# Altium schematic sheet NvideaJetsonPeripherals.SchDoc: Nvidea Jetson Peripherals
size A3; Organization: WACT^2 (QUT) - DRC; Address1: Cooper Richmond
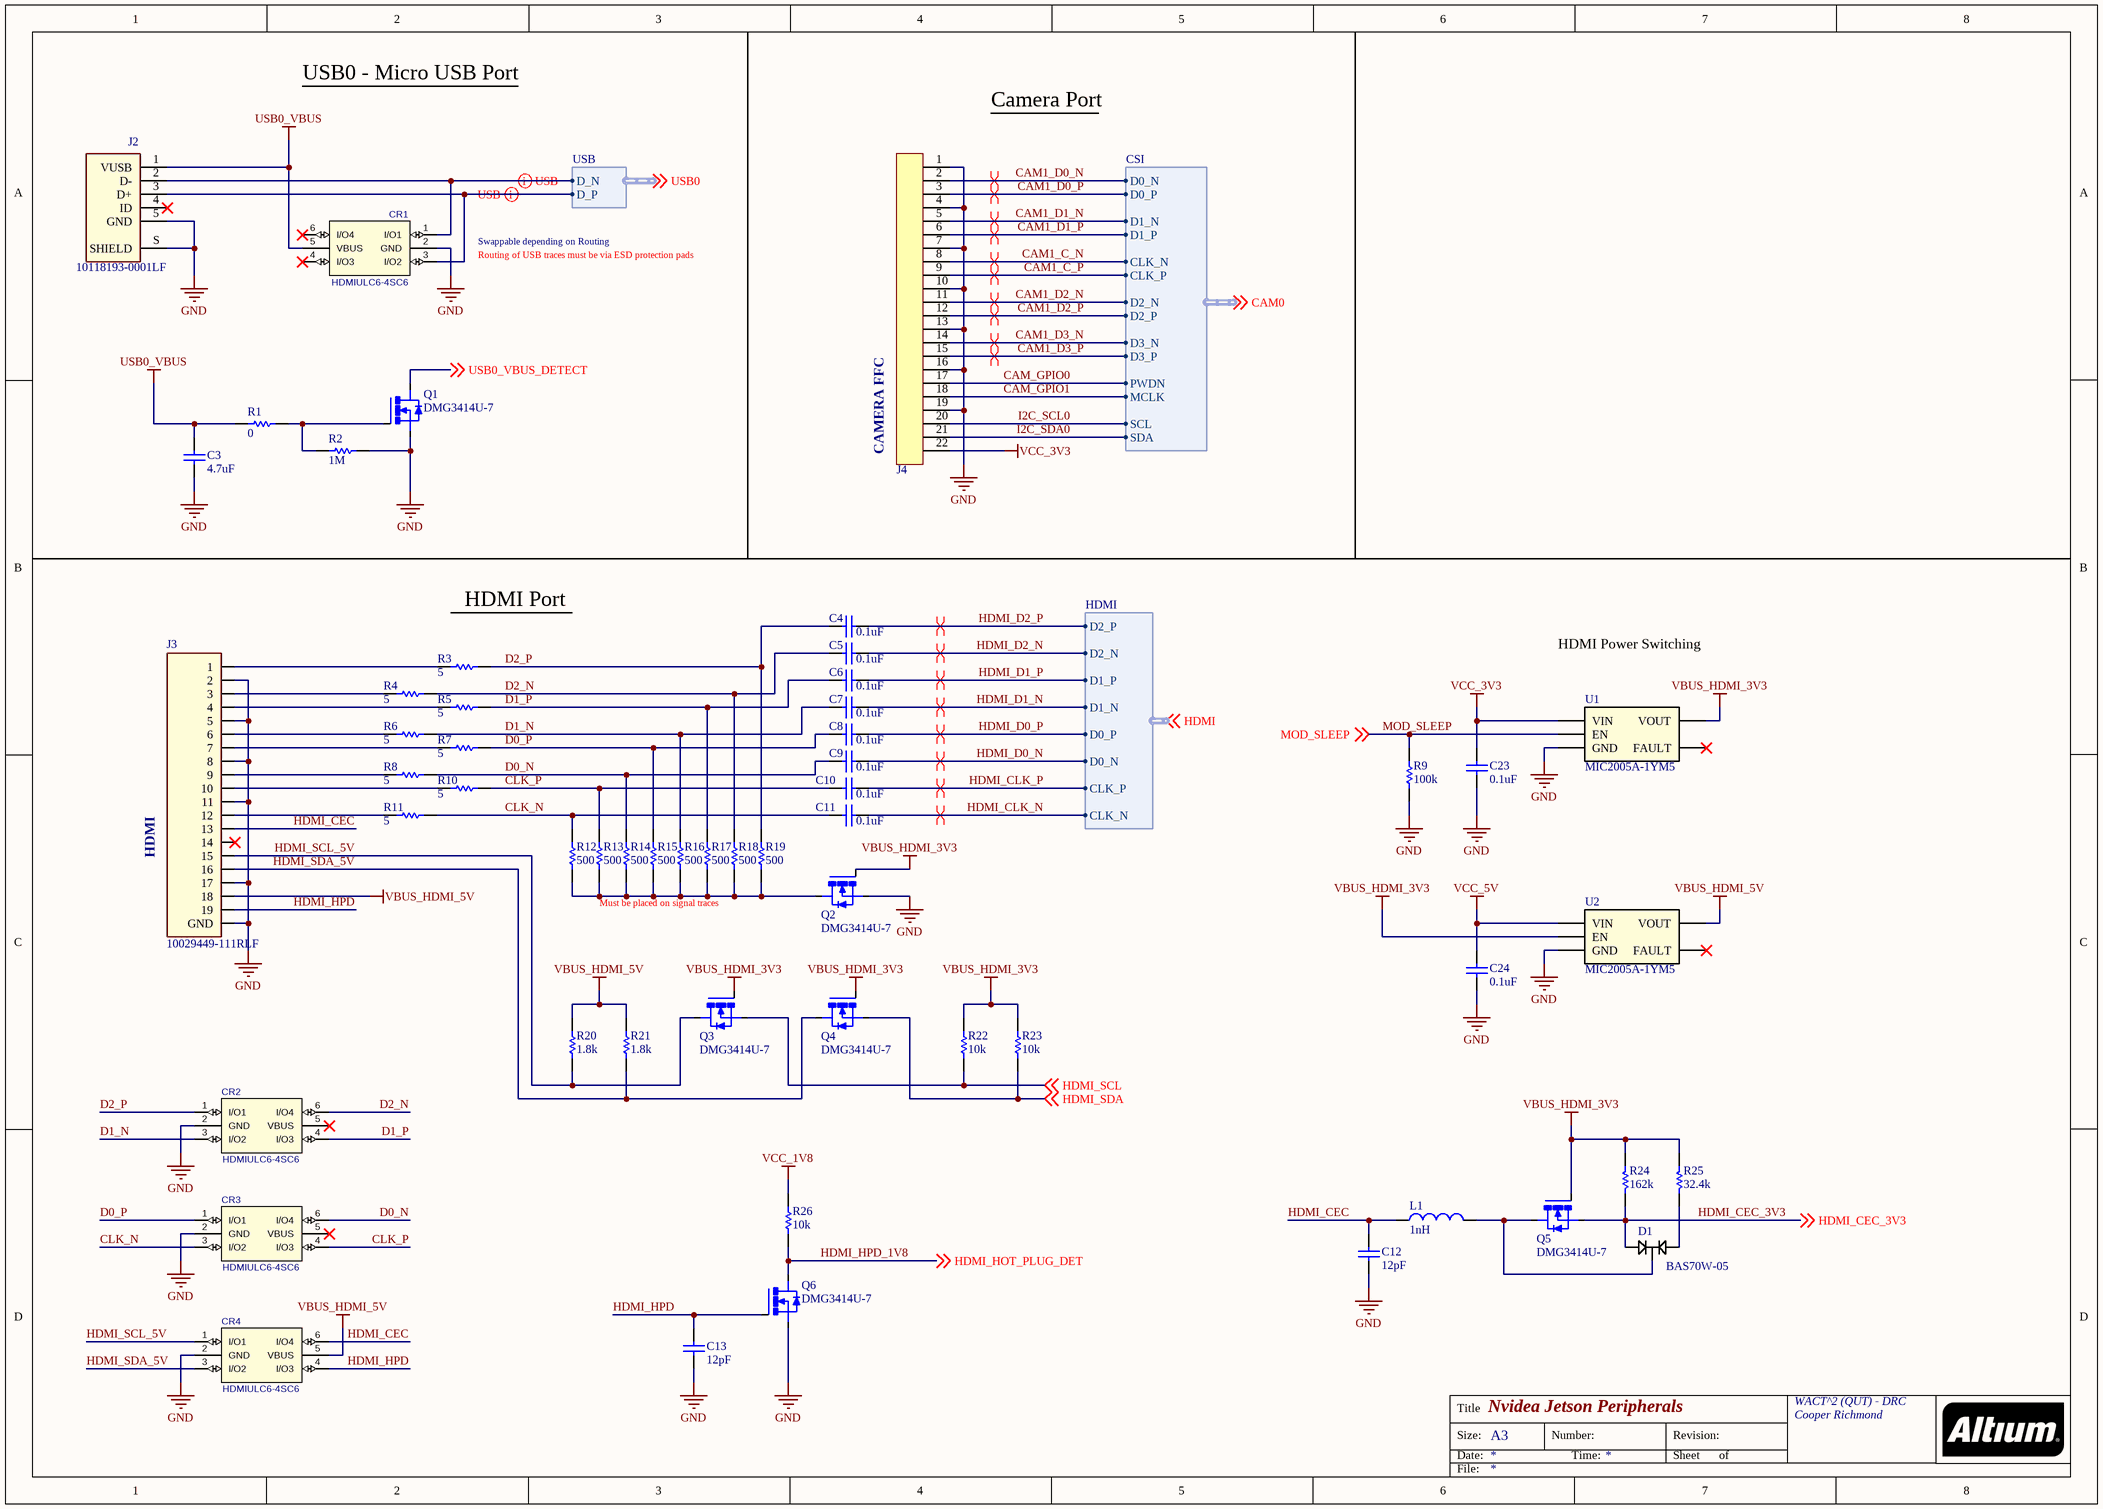
[diagram p0: NvideaJetsonPeripherals.SchDoc]

## Parts
C3  value 4.7uF  [CASE-A]  (hidden comment: CAP)
C4  value 0.1uF  [C0402]  (hidden comment: CAP)
C5  value 0.1uF  [C0402]  (hidden comment: CAP)
C6  value 0.1uF  [C0402]  (hidden comment: CAP)
C7  value 0.1uF  [C0402]  (hidden comment: CAP)
C8  value 0.1uF  [C0402]  (hidden comment: CAP)
C9  value 0.1uF  [C0402]  (hidden comment: CAP)
C10  value 0.1uF  [C0402]  (hidden comment: CAP)
C11  value 0.1uF  [C0402]  (hidden comment: CAP)
C12  value 12pF  [C0402]  (hidden comment: CAP)
C13  value 12pF  [C0402]  (hidden comment: CAP)
C23  value 0.1uF  [C0402]  (hidden comment: CAP)
C24  value 0.1uF  [C0402]  (hidden comment: CAP)
CR1  HDMIULC6-4SC6  [SOT23-6L]
CR2  HDMIULC6-4SC6  [SOT23-6L]
CR3  HDMIULC6-4SC6  [SOT23-6L]
CR4  HDMIULC6-4SC6  [SOT23-6L]
D1  BAS70W-05  [SOT323-3]
J2  10118193-0001LF  [10118193-0001LF]
J3  10029449-111RLF  [10029449-111RLF]
J4  5019512210  [5019512210]  (value not drawn)
L1  value 1nH  [L0402]  (hidden comment: IND)
Q1  DMG3414U-7  [SOT23-3]
Q2  DMG3414U-7  [SOT23-3]
Q3  DMG3414U-7  [SOT23-3]
Q4  DMG3414U-7  [SOT23-3]
Q5  DMG3414U-7  [SOT23-3]
Q6  DMG3414U-7  [SOT23-3]
R1  value 0  [R0402]  (hidden comment: RES)
R2  value 1M  [R0402]  (hidden comment: RES)
R3  value 5  [R0402]  (hidden comment: RES)
R4  value 5  [R0402]  (hidden comment: RES)
R5  value 5  [R0402]  (hidden comment: RES)
R6  value 5  [R0402]  (hidden comment: RES)
R7  value 5  [R0402]  (hidden comment: RES)
R8  value 5  [R0402]  (hidden comment: RES)
R9  value 100k  [R0402]  (hidden comment: RES)
R10  value 5  [R0402]  (hidden comment: RES)
R11  value 5  [R0402]  (hidden comment: RES)
R12  value 500  [R0402]  (hidden comment: RES)
R13  value 500  [R0402]  (hidden comment: RES)
R14  value 500  [R0402]  (hidden comment: RES)
R15  value 500  [R0402]  (hidden comment: RES)
R16  value 500  [R0402]  (hidden comment: RES)
R17  value 500  [R0402]  (hidden comment: RES)
R18  value 500  [R0402]  (hidden comment: RES)
R19  value 500  [R0402]  (hidden comment: RES)
R20  value 1.8k  [R0402]  (hidden comment: RES)
R21  value 1.8k  [R0402]  (hidden comment: RES)
R22  value 10k  [R0402]  (hidden comment: RES)
R23  value 10k  [R0402]  (hidden comment: RES)
R24  value 162k  [R0402]  (hidden comment: RES)
R25  value 32.4k  [R0402]  (hidden comment: RES)
R26  value 10k  [R0402]  (hidden comment: RES)
U1  MIC2005A-1YM5  [SOT23-5]
U2  MIC2005A-1YM5  [SOT23-5]

## Harnesses
USB: D_N, D_P
HDMI: D2_N, D2_P, D1_N, D1_P, D0_N, D0_P, CLK_N, CLK_P
CSI: D0_N, D0_P, D1_N, D1_P, CLK_N, CLK_P, D2_N, D2_P, D3_N, D3_P, PWDN, MCLK, SCL, SDA

## Nets
GND: C3.2 C12.2 C13.2 C23.1 C24.1 CR1.2(GND) CR2.2(GND) CR3.2(GND) CR4.2(GND) J2.5(GND) J2.S(SHIELD) J3.0(GND) J3.2 J3.5 J3.8 J3.11 J3.17 J4.1 J4.4 J4.7 J4.10 J4.13 J4.16 J4.19 Q1.2(S) Q2.2(S) Q6.2(S) R2.1 R9.2 U1.2(GND) U2.2(GND)
USB0_VBUS: C3.1 CR1.5(VBUS) J2.1(VUSB) R1.1
VBUS_HDMI_3V3: Q2.1(G) Q3.1(G) Q4.1(G) Q5.1(G) R22.1 R23.1 R24.1 R25.1 U1.5(VOUT) U2.3(EN)
VBUS_HDMI_5V: CR4.5(VBUS) J3.18 R20.1 R21.1 U2.5(VOUT)
VCC_1V8: R26.1
VCC_3V3: C23.2 J4.22 U1.1(VIN)
VCC_5V: C24.2 U2.1(VIN)
CAM1_C_N: J4.8 ; harness CSI.CLK_N
CAM1_C_P: J4.9 ; harness CSI.CLK_P
CAM1_D0_N: J4.2 ; harness CSI.D0_N
CAM1_D0_P: J4.3 ; harness CSI.D0_P
CAM1_D1_N: J4.5 ; harness CSI.D1_N
CAM1_D1_P: J4.6 ; harness CSI.D1_P
CAM1_D2_N: J4.11 ; harness CSI.D2_N
CAM1_D2_P: J4.12 ; harness CSI.D2_P
CAM1_D3_N: J4.14 ; harness CSI.D3_N
CAM1_D3_P: J4.15 ; harness CSI.D3_P
CAM_GPIO0: J4.17 ; harness CSI.PWDN
CAM_GPIO1: J4.18 ; harness CSI.MCLK
CLK_N: C11.1 CR3.3(I/O2) R11.2 R12.1
CLK_P: C10.1 CR3.4(I/O3) R10.2 R13.1
D0_N: C9.1 CR3.6(I/O4) R8.2 R14.1
D0_P: C8.1 CR3.1(I/O1) R7.2 R15.1
D1_N: C7.1 CR2.3(I/O2) R6.2 R16.1
D1_P: C6.1 CR2.4(I/O3) R5.2 R17.1
D2_N: C5.1 CR2.6(I/O4) R4.2 R18.1
D2_P: C4.1 CR2.1(I/O1) R3.2 R19.1
HDMI_CEC: C12.1 CR4.6(I/O4) J3.13 L1.2
HDMI_CEC_3V3: D1.1 Q5.2(S) R24.2 ; off-sheet HDMI_CEC_3V3
HDMI_CLK_N: C11.2 ; harness HDMI.CLK_N
HDMI_CLK_P: C10.2 ; harness HDMI.CLK_P
HDMI_D0_N: C9.2 ; harness HDMI.D0_N
HDMI_D0_P: C8.2 ; harness HDMI.D0_P
HDMI_D1_N: C7.2 ; harness HDMI.D1_N
HDMI_D1_P: C6.2 ; harness HDMI.D1_P
HDMI_D2_N: C5.2 ; harness HDMI.D2_N
HDMI_D2_P: C4.2 ; harness HDMI.D2_P
HDMI_HPD: C13.1 CR4.4(I/O3) J3.19 Q6.1(G)
HDMI_HPD_1V8: Q6.3(D) R26.2 ; off-sheet HDMI_HOT_PLUG_DET  [also labelled HDMI_HOT_PLUG_DET]
HDMI_SCL: Q3.2(S) R22.2 ; off-sheet HDMI_SCL
HDMI_SCL_5V: CR4.1(I/O1) J3.15 Q3.3(D) R20.2
HDMI_SDA: Q4.2(S) R23.2 ; off-sheet HDMI_SDA
HDMI_SDA_5V: CR4.3(I/O2) J3.16 Q4.3(D) R21.2
I2C_SCL0: J4.20 ; harness CSI.SCL
I2C_SDA0: J4.21 ; harness CSI.SDA
MOD_SLEEP: R9.1 U1.3(EN) ; off-sheet MOD_SLEEP
USB0_VBUS_DETECT: Q1.3(D) ; off-sheet USB0_VBUS_DETECT
NetCR1_1: CR1.1(I/O1) J2.2(D-) ; harness USB.D_N
NetCR1_3: CR1.3(I/O2) J2.3(D+) ; harness USB.D_P
NetD1_2: D1.2 R25.2
NetD1_3: D1.3 L1.1 Q5.3(D)
NetJ3_1: J3.1 R3.1
NetJ3_3: J3.3 R4.1
NetJ3_4: J3.4 R5.1
NetJ3_6: J3.6 R6.1
NetJ3_7: J3.7 R7.1
NetJ3_9: J3.9 R8.1
NetJ3_10: J3.10 R10.1
NetJ3_12: J3.12 R11.1
NetQ1_1: Q1.1(G) R1.2 R2.2
NetQ2_3: Q2.3(D) R12.2 R13.2 R14.2 R15.2 R16.2 R17.2 R18.2 R19.2

Not connected (* = marked no-connect by the designer): CR1 4(I/O3)* 6(I/O4)*; CR2 5(VBUS)*; CR3 5(VBUS)*; J2 4(ID)*; J3 14*; U1 4(FAULT)*; U2 4(FAULT)*

## Layout directives
differential pair; differential pair class DIFF: NetCR1_1, NetCR1_3
differential pair; differential pair class DIFF; net class HDMI: HDMI_CLK_N, HDMI_CLK_P, HDMI_D0_N, HDMI_D0_P, HDMI_D1_N, HDMI_D1_P, HDMI_D2_N, HDMI_D2_P
differential pair; differential pair class DIFF; net class CSI: CAM1_C_N, CAM1_C_P, CAM1_D0_N, CAM1_D0_P, CAM1_D1_N, CAM1_D1_P, CAM1_D2_N, CAM1_D2_P, CAM1_D3_N, CAM1_D3_P

## Notes on the sheet
- USB0 - Micro USB Port
- Camera Port
- Swappable depending on Routing
- Routing of USB traces must be via ESD protection pads
- (near J4) CAMERA FFC
- HDMI Port
- HDMI Power Switching
- HDMI
- Must be placed on signal traces
- Labels drawn without touching a wire or pin: CAM0, HDMI, USB0
- Title
- Size:
- Date:
- A3
- Number:
- Time:
- Revision:
- Sheet
- of
- File:

## Library data of the parts
C3-C13 C23 C24 = CAP: =Description
CR1-CR4 = HDMIULC6-4SC6: C: Copyright (C) 2015 Accelerated Designs. All rights reserved; Vendor: STMicroelectronics; Built_By: EMA_UL_Team; Value: HDMIULC6-4SC6
  CR1: Manufacturer_Part_Number: HDMIULC6-4SC6
  CR2-CR4: Part_Number: HDMIULC6-4SC6
D1 = BAS70W-05: SURFACE MOUNT SCHOTTKY BARRIER DIODE; Manufacturers Part No: BAS70W-05
J2 = 10118193-0001LF: Single Port 5 Contact Shielded SMT MICRO USB B-Type Receptacle; MF: Amphenol ICC; Package: None; Digi-Key_Part_Number: 609-4616-1-ND; MP: 10118193-0001LF; Digi-Key_Purchase_URL: https://www.digikey.com.au/product-detail/en/amphenol-icc-fci/10118193-0001LF/609-4616-1-ND/2785380?utm_source=snapeda&utm_medium=aggregator&utm_campaign=symbol; SnapEDA_Link: https://www.snapeda.com/parts/10118193-0001LF/Amphenol%20ICC/view-part/?ref=snap; Value: *
J3 = 10029449-111RLF: CONN RCPT 1.4 HDMI 19POS R/A; Part_Number: 10029449-111RLF
J4 = HDR_1x22: FFC 22 POS VERT; Part_Number: 5019512210
L1 = IND: =Description
Q1-Q4 = MOSFET_N_GSD: =Description; Manufacturer Part No: DMG3414U-7
Q5 Q6 = MOSFET_N_GSD: N Channel MOSFET, SOT23; Part_Number: DMG3414U-7
R1-R26 = RES: =Description
U1 U2 = MIC2005A-1YM5: Power Switch/Driver 1:1 P-Channel 500mA SOT-23-5; Manufacturer Part No: MIC2005A-1YM5